# EAGLE design schema esp01 (EAGLE 7.3.0)
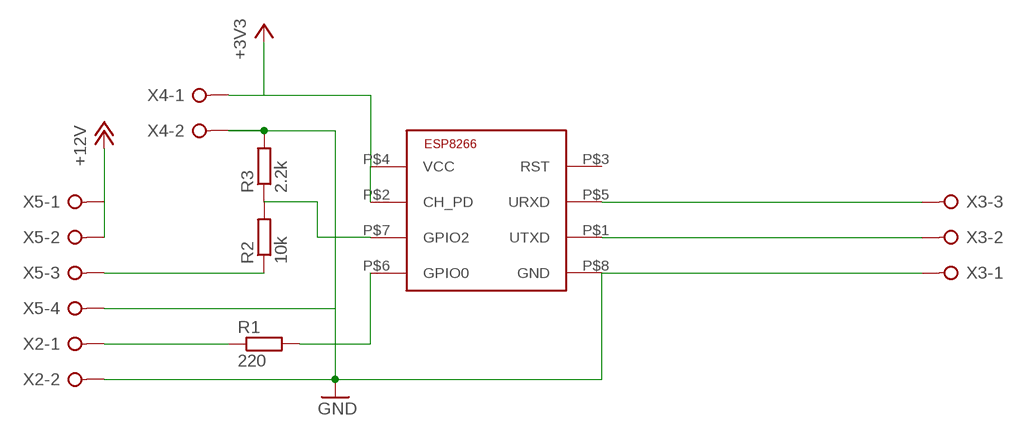
[diagram p0: schematic, sheet 1]

## Parts
R1  220  R-EU_0204/7  [0204/7]
R2  10k  R-EU_0204/7  [0204/7]
R3  2.2k  R-EU_0204/7  [0204/7]
U$1  ESP8266-01  [ESP-01]
X2  W237-02P  [W237-132]
X3  W237-3E  [W237-3E]
X4  W237-02P  [W237-132]
X5  W237-04P  [W237-4P]

## Nets
+3V3: U$1.P$2(CH_PD) U$1.P$4(VCC) X4.1
+12V: X5.1 X5.2
GND: R3.2 U$1.P$8(GND) X2.2 X3.1 X4.2 X5.4
N$1: R2.1 X5.3
N$2: R1.1 X2.1
N$3: R1.2 U$1.P$6(GPIO0)
N$5: U$1.P$5(URXD) X3.3
N$6: U$1.P$1(UTXD) X3.2
N$7: R2.2 R3.1 U$1.P$7(GPIO2)
Unconnected: U$1.P$3(RST)

## Library data of the parts
R1-R3 = rcl:R-EU_: RESISTOR, European symbol
U$1 = ESP8266:ESP8266-01: ESP8266 - ESP-01 Module
X2 X4 = con-wago-508:W237-02P: WAGO SREW CLAMP; OC_FARNELL: unknown; OC_NEWARK: unknown
X3 = con-wago-508:W237-3E: WAGO SREW CLAMP; OC_FARNELL: unknown; OC_NEWARK: unknown
X5 = con-wago-508:W237-04P: WAGO SREW CLAMP; OC_FARNELL: unknown; OC_NEWARK: unknown

## Board
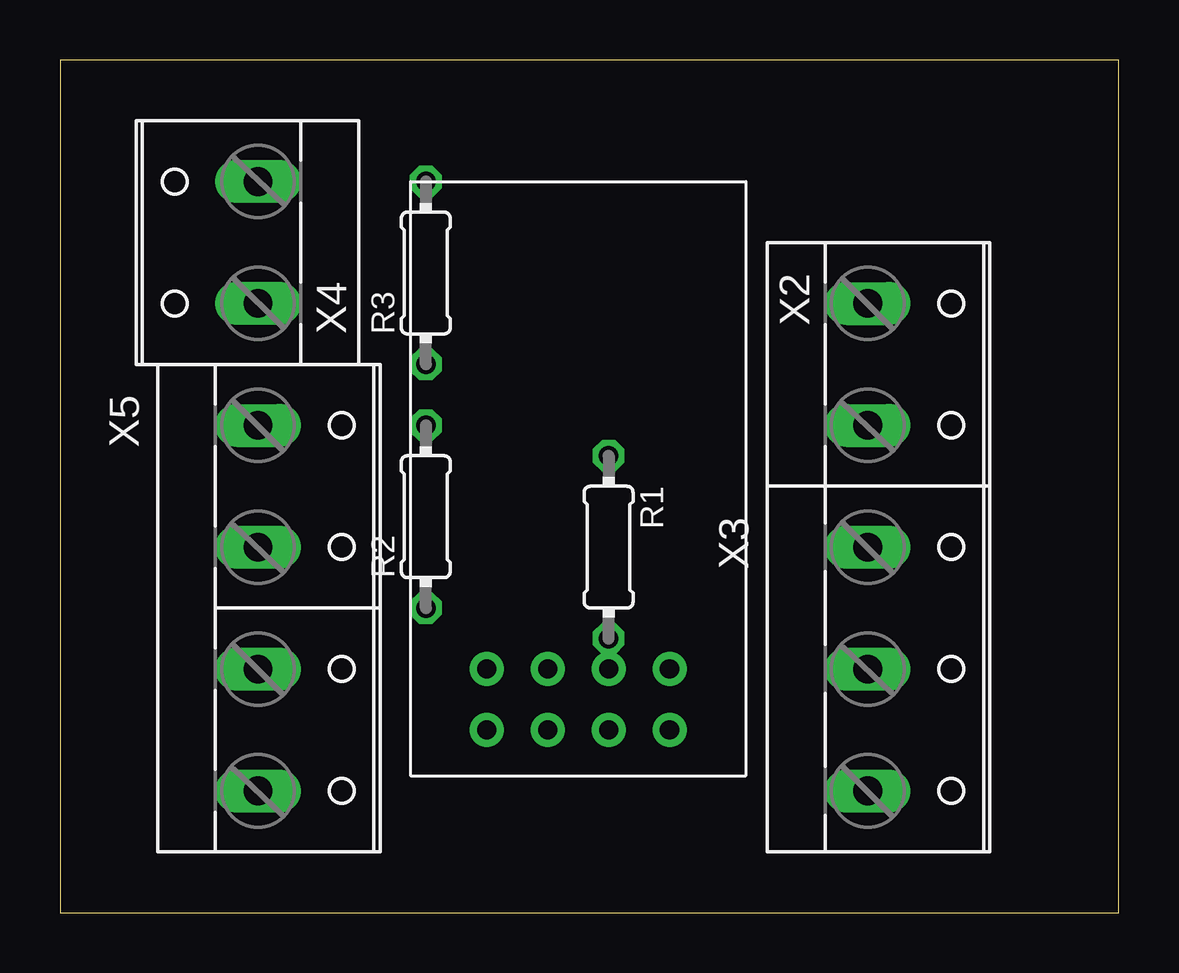
[diagram p1: board, top side]
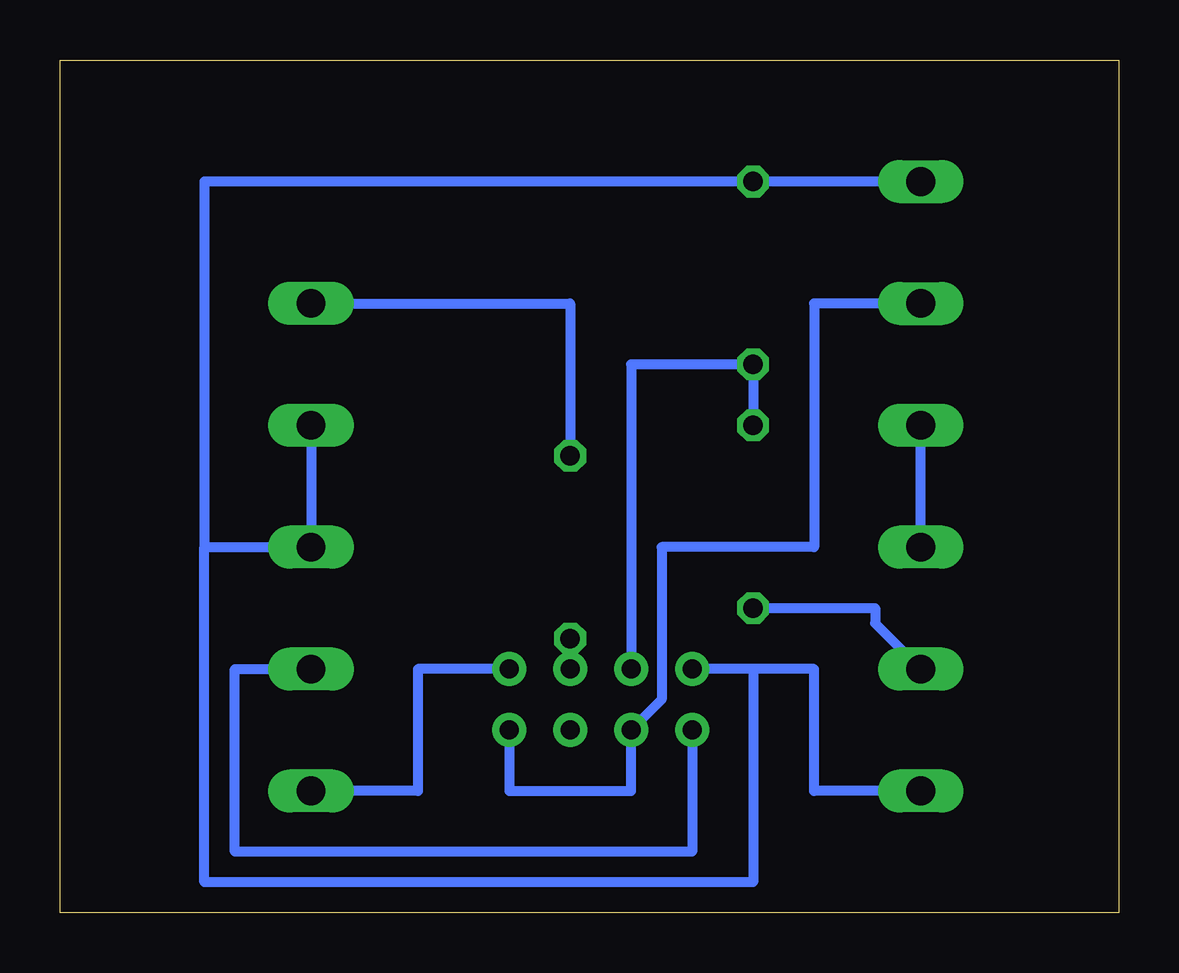
[diagram p2: board, bottom side, seen from below]

Size 44.12 x 35.55 mm. Coordinates in mm from the lower left corner, seen from the top.
Outline: 0,0 44.12,0 44.12,35.55 0,35.55 0,0
Copper layers (1*16): Top 0.035mm / dielectric 1.5mm / Bottom 0.035mm
Design rules "default": minimum track width 10mil, minimum drill 24mil, track to track 8mil, track to pad 8mil, pad to pad 8mil, via to via 8mil, smd to smd 8mil, copper to edge 40mil, drill to drill 8mil, minimum pad ring 10mil, minimum via ring 8mil, stop-mask expansion 4mil, vias tented up to drill 0mil, thermal gap 10mil

### Footprints (pad centres in the part's own frame; a part is rotated, then mirrored left to right if it is on the bottom)
0204/7 = drill 0.813 octagon: 1 -3.81,0; 2 3.81,0
ESP-01 = drill 0.8 pad 1.422: P$1 0,0; P$2 2.54,0; P$3 5.08,0; P$4 7.62,0; P$5 7.62,2.54; P$6 5.08,2.54; P$7 2.54,2.54; P$8 0,2.54
W237-132 = drill 1.194 long: 1 -2.54,-0.635; 2 2.54,-0.635
W237-3E = drill 1.194 long: 1 -5.08,-0.635; 2 0,-0.635; 3 5.08,-0.635
W237-4P = drill 1.194 long: 1 -7.62,-0.635; 2 -2.54,-0.635; 3 2.54,-0.635; 4 7.62,-0.635

### Placement (x,y rotation side)
R1  22.86,15.24 270 top
R2  15.24,16.51 90 top
R3  15.24,26.67 90 top
U$1  17.78,7.62 0 top
X2  34.29,22.86 270 top
X3  34.29,10.16 270 top
X4  7.62,27.94 90 top
X5  8.89,12.7 270 top

### Tracks (layer width: path | path; a pad name or v marks a point on that pad's centre or on a via)
+3V3
  Bottom 0.406: U$1.P$4 25.4,5.08 20.32,5.08 U$1.P$2 19.05,8.89 19.05,15.24 12.7,15.24 12.7,25.4 X4.1
+12V
  Bottom 0.406: X5.2 X5.1
GND
  Bottom 0.406: X4.2 R3.2 38.1,30.48 38.1,15.24 | 15.24,10.16 15.24,1.27 38.1,1.27 38.1,15.24 | 38.1,15.24 X3.1 X2.2 | X5.4 12.7,5.08 12.7,10.16 15.24,10.16 | 15.24,10.16 U$1.P$8
N$1
  Bottom 0.406: R2.1 10.16,12.7 10.16,12.06 X5.3
N$2
  Bottom 0.406: X2.1 22.86,25.4 R1.1
N$3
  Bottom 0.406: U$1.P$6 R1.2
N$5
  Bottom 0.406: X3.3 29.21,5.08 29.21,10.16 U$1.P$5
N$6
  Bottom 0.406: U$1.P$1 17.78,2.54 36.83,2.54 36.83,10.16 X3.2
N$7
  Bottom 0.406: U$1.P$7 20.32,22.86 R3.1 R2.2